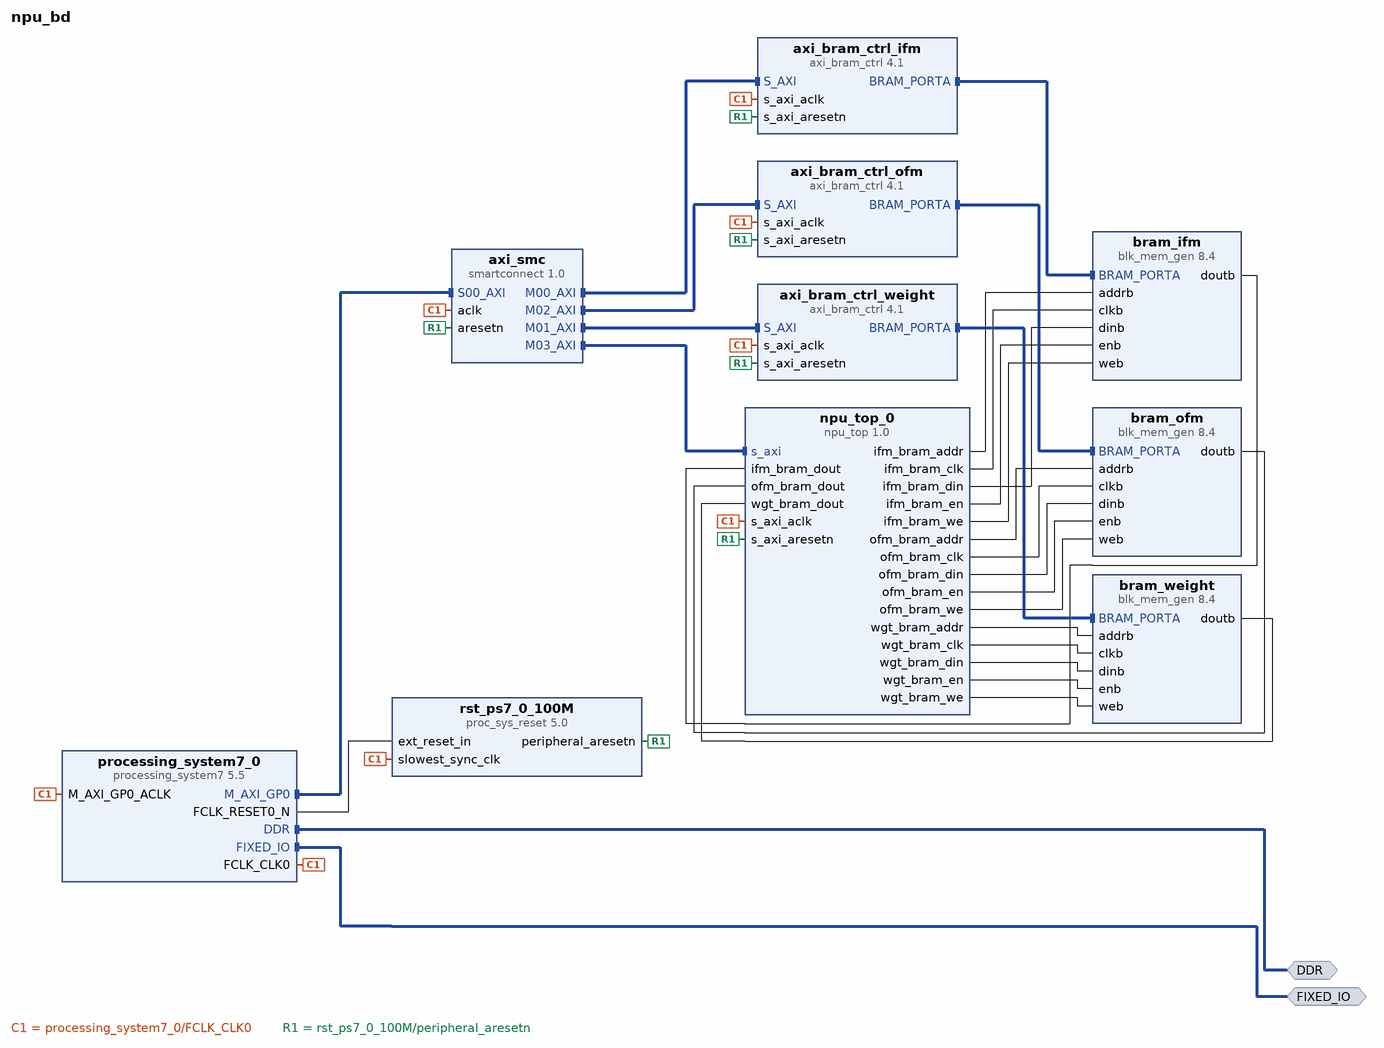
[diagram p0: block diagram of the top level]
# Vivado block design npu_bd, xc7z020clg400-1, Vivado 2022.1
create_bd_design npu_bd

create_bd_intf_port -mode Master -vlnv xilinx.com:interface:ddrx_rtl:1.0 DDR
create_bd_intf_port -mode Master -vlnv xilinx.com:display_processing_system7:fixedio_rtl:1.0 FIXED_IO

create_bd_cell -type ip -vlnv xilinx.com:ip:processing_system7:5.5 processing_system7_0
set_property -dict [list \
  CONFIG.PCW_APU_PERIPHERAL_FREQMHZ 666.666666 \
  CONFIG.PCW_ENET0_PERIPHERAL_ENABLE 0 \
  CONFIG.PCW_FPGA0_PERIPHERAL_FREQMHZ 50 \
  CONFIG.PCW_FPGA1_PERIPHERAL_FREQMHZ 50 \
  CONFIG.PCW_GPIO_MIO_GPIO_ENABLE 0 \
  CONFIG.PCW_PERIPHERAL_BOARD_PRESET None \
  CONFIG.PCW_PRESET_BANK1_VOLTAGE {LVCMOS 3.3V} \
  CONFIG.PCW_QSPI_PERIPHERAL_ENABLE 0 \
  CONFIG.PCW_SD0_PERIPHERAL_ENABLE 0 \
  CONFIG.PCW_UART1_PERIPHERAL_ENABLE 0 \
  CONFIG.PCW_UIPARAM_DDR_FREQ_MHZ 533.333333 \
  CONFIG.PCW_UIPARAM_DDR_PARTNO {MT41J128M8 JP-125} \
  CONFIG.PCW_USB0_PERIPHERAL_ENABLE 0 \
  CONFIG.preset None \
] [get_bd_cells processing_system7_0]
# 329 more settings of processing_system7_0 are not shown: defaults, MIO pin electricals, DDR timing, and values the tool derives
create_bd_cell -type ip -vlnv xilinx.com:ip:blk_mem_gen:8.4 bram_ifm
set_property -dict [list \
  CONFIG.Enable_B Use_ENB_Pin \
  CONFIG.Memory_Type True_Dual_Port_RAM \
  CONFIG.Read_Width_A 32 \
  CONFIG.Read_Width_B 32 \
  CONFIG.Register_PortA_Output_of_Memory_Primitives false \
  CONFIG.Register_PortB_Output_of_Memory_Primitives false \
  CONFIG.Write_Width_A 32 \
  CONFIG.Write_Width_B 32 \
] [get_bd_cells bram_ifm]
create_bd_cell -type ip -vlnv xilinx.com:ip:blk_mem_gen:8.4 bram_weight
set_property -dict [list \
  CONFIG.Enable_B Use_ENB_Pin \
  CONFIG.Memory_Type True_Dual_Port_RAM \
  CONFIG.Read_Width_A 32 \
  CONFIG.Read_Width_B 32 \
  CONFIG.Register_PortA_Output_of_Memory_Primitives false \
  CONFIG.Register_PortB_Output_of_Memory_Primitives false \
  CONFIG.Write_Width_A 32 \
  CONFIG.Write_Width_B 32 \
] [get_bd_cells bram_weight]
create_bd_cell -type ip -vlnv xilinx.com:ip:blk_mem_gen:8.4 bram_ofm
set_property -dict [list \
  CONFIG.Enable_B Use_ENB_Pin \
  CONFIG.Memory_Type True_Dual_Port_RAM \
  CONFIG.Read_Width_A 32 \
  CONFIG.Read_Width_B 32 \
  CONFIG.Register_PortA_Output_of_Memory_Primitives false \
  CONFIG.Register_PortB_Output_of_Memory_Primitives false \
  CONFIG.Write_Width_A 32 \
  CONFIG.Write_Width_B 32 \
] [get_bd_cells bram_ofm]
create_bd_cell -type ip -vlnv xilinx.com:ip:axi_bram_ctrl:4.1 axi_bram_ctrl_ifm
set_property -dict {CONFIG.SINGLE_PORT_BRAM 1} [get_bd_cells axi_bram_ctrl_ifm]
create_bd_cell -type ip -vlnv xilinx.com:ip:axi_bram_ctrl:4.1 axi_bram_ctrl_weight
set_property -dict {CONFIG.SINGLE_PORT_BRAM 1} [get_bd_cells axi_bram_ctrl_weight]
create_bd_cell -type ip -vlnv xilinx.com:ip:axi_bram_ctrl:4.1 axi_bram_ctrl_ofm
set_property -dict {CONFIG.SINGLE_PORT_BRAM 1} [get_bd_cells axi_bram_ctrl_ofm]
create_bd_cell -type ip -vlnv xilinx.com:ip:proc_sys_reset:5.0 rst_ps7_0_100M
create_bd_cell -type ip -vlnv xilinx.com:ip:smartconnect:1.0 axi_smc
set_property -dict {CONFIG.NUM_MI 4 CONFIG.NUM_SI 1} [get_bd_cells axi_smc]
create_bd_cell -type ip -vlnv xilinx.com:user:npu_top:1.0 npu_top_0

# ---- connections ----

connect_bd_intf_net [get_bd_intf_pins axi_bram_ctrl_ifm/BRAM_PORTA] [get_bd_intf_pins bram_ifm/BRAM_PORTA]
connect_bd_intf_net [get_bd_intf_pins axi_bram_ctrl_ofm/BRAM_PORTA] [get_bd_intf_pins bram_ofm/BRAM_PORTA]
connect_bd_intf_net [get_bd_intf_pins axi_bram_ctrl_weight/BRAM_PORTA] [get_bd_intf_pins bram_weight/BRAM_PORTA]
connect_bd_intf_net [get_bd_intf_pins axi_smc/M00_AXI] [get_bd_intf_pins axi_bram_ctrl_ifm/S_AXI]
connect_bd_intf_net [get_bd_intf_pins axi_smc/M01_AXI] [get_bd_intf_pins axi_bram_ctrl_weight/S_AXI]
connect_bd_intf_net [get_bd_intf_pins axi_smc/M02_AXI] [get_bd_intf_pins axi_bram_ctrl_ofm/S_AXI]
connect_bd_intf_net [get_bd_intf_pins axi_smc/M03_AXI] [get_bd_intf_pins npu_top_0/s_axi]
connect_bd_intf_net [get_bd_intf_ports DDR] [get_bd_intf_pins processing_system7_0/DDR]
connect_bd_intf_net [get_bd_intf_ports FIXED_IO] [get_bd_intf_pins processing_system7_0/FIXED_IO]
connect_bd_intf_net [get_bd_intf_pins processing_system7_0/M_AXI_GP0] [get_bd_intf_pins axi_smc/S00_AXI]
connect_bd_net [get_bd_pins bram_ifm/doutb] [get_bd_pins npu_top_0/ifm_bram_dout]
connect_bd_net [get_bd_pins bram_ofm/doutb] [get_bd_pins npu_top_0/ofm_bram_dout]
connect_bd_net [get_bd_pins bram_weight/doutb] [get_bd_pins npu_top_0/wgt_bram_dout]
connect_bd_net [get_bd_pins npu_top_0/ifm_bram_addr] [get_bd_pins bram_ifm/addrb]
connect_bd_net [get_bd_pins npu_top_0/ifm_bram_clk] [get_bd_pins bram_ifm/clkb]
connect_bd_net [get_bd_pins npu_top_0/ifm_bram_din] [get_bd_pins bram_ifm/dinb]
connect_bd_net [get_bd_pins npu_top_0/ifm_bram_en] [get_bd_pins bram_ifm/enb]
connect_bd_net [get_bd_pins npu_top_0/ifm_bram_we] [get_bd_pins bram_ifm/web]
connect_bd_net [get_bd_pins npu_top_0/ofm_bram_addr] [get_bd_pins bram_ofm/addrb]
connect_bd_net [get_bd_pins npu_top_0/ofm_bram_clk] [get_bd_pins bram_ofm/clkb]
connect_bd_net [get_bd_pins npu_top_0/ofm_bram_din] [get_bd_pins bram_ofm/dinb]
connect_bd_net [get_bd_pins npu_top_0/ofm_bram_en] [get_bd_pins bram_ofm/enb]
connect_bd_net [get_bd_pins npu_top_0/ofm_bram_we] [get_bd_pins bram_ofm/web]
connect_bd_net [get_bd_pins npu_top_0/wgt_bram_addr] [get_bd_pins bram_weight/addrb]
connect_bd_net [get_bd_pins npu_top_0/wgt_bram_clk] [get_bd_pins bram_weight/clkb]
connect_bd_net [get_bd_pins npu_top_0/wgt_bram_din] [get_bd_pins bram_weight/dinb]
connect_bd_net [get_bd_pins npu_top_0/wgt_bram_en] [get_bd_pins bram_weight/enb]
connect_bd_net [get_bd_pins npu_top_0/wgt_bram_we] [get_bd_pins bram_weight/web]
connect_bd_net [get_bd_pins processing_system7_0/FCLK_CLK0] \
  [get_bd_pins rst_ps7_0_100M/slowest_sync_clk] [get_bd_pins axi_smc/aclk] [get_bd_pins axi_bram_ctrl_ifm/s_axi_aclk] \
  [get_bd_pins axi_bram_ctrl_weight/s_axi_aclk] [get_bd_pins axi_bram_ctrl_ofm/s_axi_aclk] \
  [get_bd_pins processing_system7_0/M_AXI_GP0_ACLK] [get_bd_pins npu_top_0/s_axi_aclk]
connect_bd_net [get_bd_pins processing_system7_0/FCLK_RESET0_N] [get_bd_pins rst_ps7_0_100M/ext_reset_in]
connect_bd_net [get_bd_pins rst_ps7_0_100M/peripheral_aresetn] \
  [get_bd_pins axi_smc/aresetn] [get_bd_pins axi_bram_ctrl_ifm/s_axi_aresetn] \
  [get_bd_pins axi_bram_ctrl_weight/s_axi_aresetn] [get_bd_pins axi_bram_ctrl_ofm/s_axi_aresetn] \
  [get_bd_pins npu_top_0/s_axi_aresetn]
set_property HDL_ATTRIBUTE.BMM_INFO_PROCESSOR {arm > npu_bd axi_bram_ctrl_ifm npu_bd axi_bram_ctrl_weight npu_bd axi_bram_ctrl_ofm} [get_bd_cells processing_system7_0]
set_property HDL_ATTRIBUTE.KEEP_HIERARCHY yes [get_bd_cells processing_system7_0]
set_property HDL_ATTRIBUTE.BMM_INFO_ADDRESS_SPACE {byte  0x40010000 32 > npu_bd bram_ifm} [get_bd_cells axi_bram_ctrl_ifm]
set_property HDL_ATTRIBUTE.KEEP_HIERARCHY yes [get_bd_cells axi_bram_ctrl_ifm]
set_property HDL_ATTRIBUTE.BMM_INFO_ADDRESS_SPACE {byte  0x40020000 32 > npu_bd bram_weight} [get_bd_cells axi_bram_ctrl_weight]
set_property HDL_ATTRIBUTE.KEEP_HIERARCHY yes [get_bd_cells axi_bram_ctrl_weight]
set_property HDL_ATTRIBUTE.BMM_INFO_ADDRESS_SPACE {byte  0x40040000 32 > npu_bd bram_ofm} [get_bd_cells axi_bram_ctrl_ofm]
set_property HDL_ATTRIBUTE.KEEP_HIERARCHY yes [get_bd_cells axi_bram_ctrl_ofm]

# ---- address map ----
assign_bd_address -offset 0x40000000 -range 4K -target_address_space [get_bd_addr_spaces processing_system7_0/Data] [get_bd_addr_segs npu_top_0/s_axi/reg0]
assign_bd_address -offset 0x40010000 -range 64K -target_address_space [get_bd_addr_spaces processing_system7_0/Data] [get_bd_addr_segs axi_bram_ctrl_ifm/S_AXI/Mem0]
assign_bd_address -offset 0x40020000 -range 128K -target_address_space [get_bd_addr_spaces processing_system7_0/Data] [get_bd_addr_segs axi_bram_ctrl_weight/S_AXI/Mem0]
assign_bd_address -offset 0x40040000 -range 256K -target_address_space [get_bd_addr_spaces processing_system7_0/Data] [get_bd_addr_segs axi_bram_ctrl_ofm/S_AXI/Mem0]

validate_bd_design
save_bd_design
